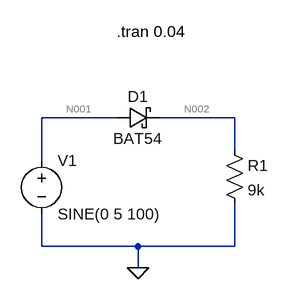
[diagram p0: schematic Lab2 Part 2 (20101299).asc]
Lab2 Part 2 (20101299).asc, the LTspice schematic file:
Version 4
SHEET 1 880 680
WIRE 80 32 -32 32
WIRE 256 32 144 32
WIRE 256 80 256 32
WIRE -32 96 -32 32
WIRE -32 224 -32 176
WIRE 112 224 -32 224
WIRE 256 224 256 160
WIRE 256 224 112 224
WIRE 112 256 112 224
FLAG 112 256 0
SYMBOL voltage -32 80 R0
WINDOW 123 0 0 Left 0
WINDOW 39 0 0 Left 0
SYMATTR InstName V1
SYMATTR Value SINE(0 5 100)
SYMBOL res 240 64 R0
SYMATTR InstName R1
SYMATTR Value 9k
SYMBOL schottky 80 48 R270
WINDOW 0 32 32 VTop 2
WINDOW 3 0 32 VBottom 2
SYMATTR InstName D1
SYMATTR Value BAT54
SYMATTR Description Diode
SYMATTR Type diode
TEXT 80 -96 Left 2 !.tran 0.04

The netlist it stands for:
* Lab2 Part 2 (20101299).asc
V1 N001 0 SINE(0 5 100)
R1 N002 0 9k
D1 N001 N002 BAT54
.model D D
.lib standard.dio
.tran 0.04
.backanno
.end

* Results of the author's LTspice run, read from the files saved beside the schematic
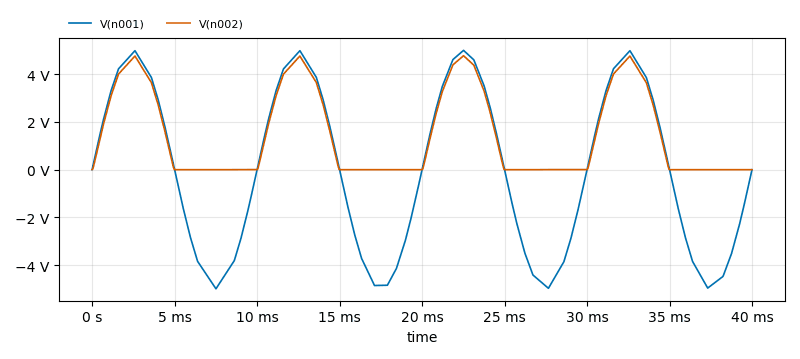
[diagram p1: Transient Analysis of Lab2 Part 2 (20101299).asc, plotted from the saved traces]
* Transient Analysis, 1 run:
*   V(n001): min -4.993 V, max 5 V, average 1.408 mV, rms 3.478 V, last 0 V
*   V(n002): min -1.217 mV, max 4.776 V, average 1.46 V, rms 2.324 V, last 323.6 µV